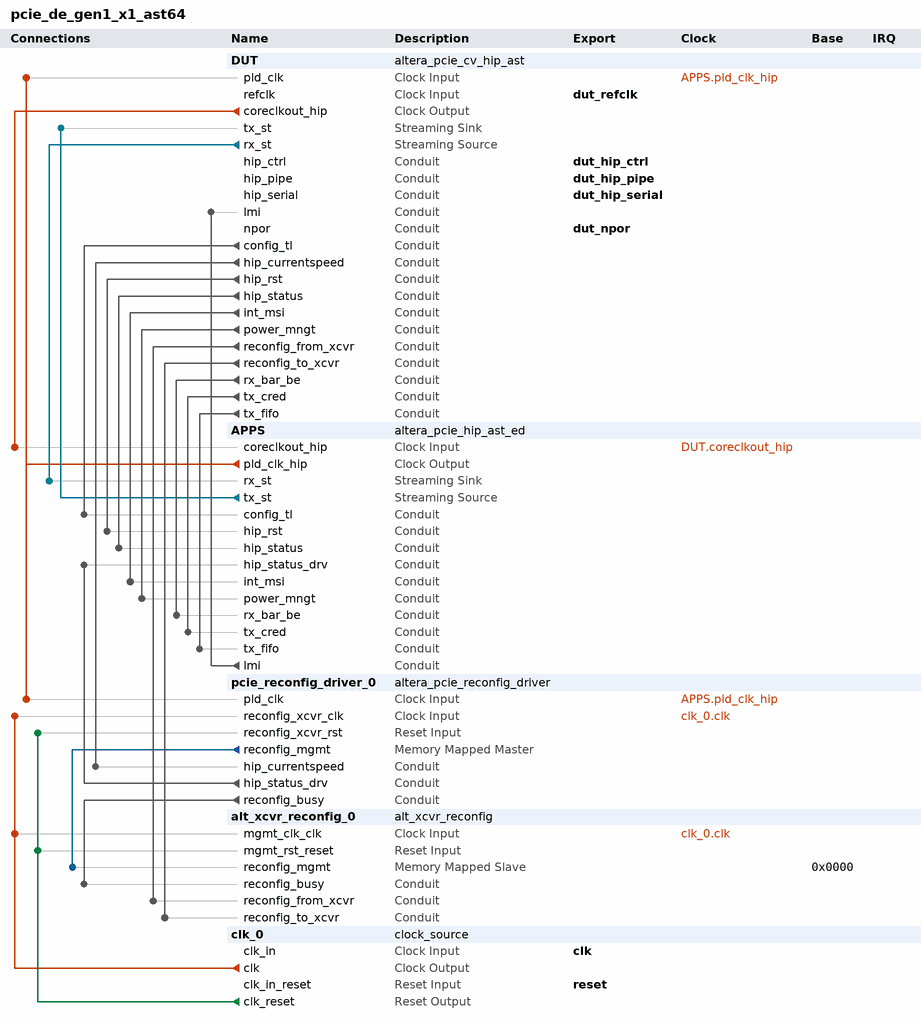
[diagram p0: system contents]
# Platform Designer (Qsys) system pcie_de_gen1_x1_ast64, Cyclone V Unknown
# Parameters at their usual value, and those the tool derives, are not listed.
package require -exact qsys 13.1
create_system pcie_de_gen1_x1_ast64
set_project_property DEVICE_FAMILY {Cyclone V}
set_project_property DEVICE Unknown

add_instance DUT altera_pcie_cv_hip_ast 13.1
set_instance_parameter_value DUT pcie_qsys 1
set_instance_parameter_value DUT altpcie_avmm_hwtcl 0
set_instance_parameter_value DUT lane_mask_hwtcl x1
set_instance_parameter_value DUT gen12_lane_rate_mode_hwtcl {Gen1 (2.5 Gbps)}
set_instance_parameter_value DUT porttype_func_hwtcl {Native endpoint}
set_instance_parameter_value DUT pcie_spec_version_hwtcl 2.1
set_instance_parameter_value DUT ast_width_hwtcl {Avalon-ST 64-bit}
set_instance_parameter_value DUT rxbuffer_rxreq_hwtcl Low
set_instance_parameter_value DUT pll_refclk_freq_hwtcl {100 MHz}
set_instance_parameter_value DUT set_pld_clk_x1_625MHz_hwtcl 0
set_instance_parameter_value DUT use_rx_st_be_hwtcl 1
set_instance_parameter_value DUT in_cvp_mode_hwtcl 0
set_instance_parameter_value DUT hip_reconfig_hwtcl 0
set_instance_parameter_value DUT num_of_func_hwtcl 1
set_instance_parameter_value DUT max_payload_size_hwtcl 128
set_instance_parameter_value DUT extend_tag_field_hwtcl 32
set_instance_parameter_value DUT completion_timeout_hwtcl ABCD
set_instance_parameter_value DUT enable_completion_timeout_disable_hwtcl 1
set_instance_parameter_value DUT use_aer_hwtcl 0
set_instance_parameter_value DUT ecrc_check_capable_hwtcl 0
set_instance_parameter_value DUT ecrc_gen_capable_hwtcl 0
set_instance_parameter_value DUT use_crc_forwarding_hwtcl 0
set_instance_parameter_value DUT port_link_number_hwtcl 1
set_instance_parameter_value DUT slotclkcfg_hwtcl 1
set_instance_parameter_value DUT enable_slot_register_hwtcl 0
set_instance_parameter_value DUT slot_power_scale_hwtcl 0
set_instance_parameter_value DUT slot_power_limit_hwtcl 0
set_instance_parameter_value DUT slot_number_hwtcl 0
set_instance_parameter_value DUT endpoint_l0_latency_hwtcl 0
set_instance_parameter_value DUT endpoint_l1_latency_hwtcl 0
set_instance_parameter_value DUT bar0_type_0_hwtcl 1
set_instance_parameter_value DUT bar0_size_mask_0_hwtcl 28
set_instance_parameter_value DUT bar1_type_0_hwtcl 0
set_instance_parameter_value DUT bar1_size_mask_0_hwtcl 0
set_instance_parameter_value DUT bar2_type_0_hwtcl 2
set_instance_parameter_value DUT bar2_size_mask_0_hwtcl 10
set_instance_parameter_value DUT bar3_type_0_hwtcl 0
set_instance_parameter_value DUT bar3_size_mask_0_hwtcl 0
set_instance_parameter_value DUT bar4_type_0_hwtcl 0
set_instance_parameter_value DUT bar4_size_mask_0_hwtcl 0
set_instance_parameter_value DUT bar5_type_0_hwtcl 0
set_instance_parameter_value DUT bar5_size_mask_0_hwtcl 0
set_instance_parameter_value DUT expansion_base_address_register_0_hwtcl 0
set_instance_parameter_value DUT io_window_addr_width_hwtcl 0
set_instance_parameter_value DUT prefetchable_mem_window_addr_width_hwtcl 0
set_instance_parameter_value DUT vendor_id_0_hwtcl 0
set_instance_parameter_value DUT device_id_0_hwtcl 1
set_instance_parameter_value DUT revision_id_0_hwtcl 1
set_instance_parameter_value DUT class_code_0_hwtcl 0
set_instance_parameter_value DUT subsystem_vendor_id_0_hwtcl 0
set_instance_parameter_value DUT subsystem_device_id_0_hwtcl 0
set_instance_parameter_value DUT flr_capability_0_hwtcl 0
set_instance_parameter_value DUT dll_active_report_support_0_hwtcl 0
set_instance_parameter_value DUT surprise_down_error_support_0_hwtcl 0
set_instance_parameter_value DUT msi_multi_message_capable_0_hwtcl 4
set_instance_parameter_value DUT msi_64bit_addressing_capable_0_hwtcl true
set_instance_parameter_value DUT msi_masking_capable_0_hwtcl false
set_instance_parameter_value DUT msi_support_0_hwtcl true
set_instance_parameter_value DUT enable_function_msix_support_0_hwtcl 0
set_instance_parameter_value DUT msix_table_size_0_hwtcl 0
set_instance_parameter_value DUT msix_table_offset_0_hwtcl 0
set_instance_parameter_value DUT msix_table_bir_0_hwtcl 0
set_instance_parameter_value DUT msix_pba_offset_0_hwtcl 0
set_instance_parameter_value DUT msix_pba_bir_0_hwtcl 0
set_instance_parameter_value DUT interrupt_pin_0_hwtcl inta
set_instance_parameter_value DUT force_hrc 0
set_instance_parameter_value DUT force_src 0
set_instance_parameter_value DUT set_l0s_hwtcl 0
set_instance_parameter_value DUT serial_sim_hwtcl 0
set_instance_parameter_value DUT override_rxbuffer_cred_preset 0
set_instance_parameter_value DUT advanced_default_parameter_override 0
set_instance_parameter_value DUT override_tbpartner_driver_setting_hwtcl 0
set_instance_parameter_value DUT enable_rx_buffer_checking_advanced_default_hwtcl false
set_instance_parameter_value DUT disable_link_x2_support_advanced_default_hwtcl false
set_instance_parameter_value DUT device_number_advanced_default_hwtcl 0
set_instance_parameter_value DUT pipex1_debug_sel_advanced_default_hwtcl disable
set_instance_parameter_value DUT pclk_out_sel_advanced_default_hwtcl pclk
set_instance_parameter_value DUT no_soft_reset_advanced_default_hwtcl false
set_instance_parameter_value DUT d1_support_advanced_default_hwtcl false
set_instance_parameter_value DUT d2_support_advanced_default_hwtcl false
set_instance_parameter_value DUT d0_pme_advanced_default_hwtcl false
set_instance_parameter_value DUT d1_pme_advanced_default_hwtcl false
set_instance_parameter_value DUT d2_pme_advanced_default_hwtcl false
set_instance_parameter_value DUT d3_hot_pme_advanced_default_hwtcl false
set_instance_parameter_value DUT d3_cold_pme_advanced_default_hwtcl false
set_instance_parameter_value DUT low_priority_vc_advanced_default_hwtcl single_vc
set_instance_parameter_value DUT enable_l1_aspm_advanced_default_hwtcl false
set_instance_parameter_value DUT l1_exit_latency_sameclock_advanced_default_hwtcl 0
set_instance_parameter_value DUT l1_exit_latency_diffclock_advanced_default_hwtcl 0
set_instance_parameter_value DUT hot_plug_support_advanced_default_hwtcl 0
set_instance_parameter_value DUT no_command_completed_advanced_default_hwtcl false
set_instance_parameter_value DUT eie_before_nfts_count_advanced_default_hwtcl 4
set_instance_parameter_value DUT gen2_diffclock_nfts_count_advanced_default_hwtcl 255
set_instance_parameter_value DUT gen2_sameclock_nfts_count_advanced_default_hwtcl 255
set_instance_parameter_value DUT deemphasis_enable_advanced_default_hwtcl false
set_instance_parameter_value DUT l0_exit_latency_sameclock_advanced_default_hwtcl 6
set_instance_parameter_value DUT l0_exit_latency_diffclock_advanced_default_hwtcl 6
set_instance_parameter_value DUT vc0_clk_enable_advanced_default_hwtcl true
set_instance_parameter_value DUT register_pipe_signals_advanced_default_hwtcl true
set_instance_parameter_value DUT tx_cdc_almost_empty_advanced_default_hwtcl 5
set_instance_parameter_value DUT rx_l0s_count_idl_advanced_default_hwtcl 0
set_instance_parameter_value DUT cdc_dummy_insert_limit_advanced_default_hwtcl 11
set_instance_parameter_value DUT ei_delay_powerdown_count_advanced_default_hwtcl 10
set_instance_parameter_value DUT skp_os_schedule_count_advanced_default_hwtcl 0
set_instance_parameter_value DUT fc_init_timer_advanced_default_hwtcl 1024
set_instance_parameter_value DUT l01_entry_latency_advanced_default_hwtcl 31
set_instance_parameter_value DUT flow_control_update_count_advanced_default_hwtcl 30
set_instance_parameter_value DUT flow_control_timeout_count_advanced_default_hwtcl 200
set_instance_parameter_value DUT retry_buffer_last_active_address_advanced_default_hwtcl 255
set_instance_parameter_value DUT reserved_debug_advanced_default_hwtcl 0
set_instance_parameter_value DUT use_tl_cfg_sync_advanced_default_hwtcl 1
set_instance_parameter_value DUT diffclock_nfts_count_advanced_default_hwtcl 255
set_instance_parameter_value DUT sameclock_nfts_count_advanced_default_hwtcl 255
set_instance_parameter_value DUT l2_async_logic_advanced_default_hwtcl disable
set_instance_parameter_value DUT rx_cdc_almost_full_advanced_default_hwtcl 12
set_instance_parameter_value DUT tx_cdc_almost_full_advanced_default_hwtcl 11
set_instance_parameter_value DUT indicator_advanced_default_hwtcl 0
set_instance_parameter_value DUT maximum_current_0_hwtcl 0
set_instance_parameter_value DUT disable_snoop_packet_0_hwtcl false
set_instance_parameter_value DUT bridge_port_vga_enable_0_hwtcl false
set_instance_parameter_value DUT bridge_port_ssid_support_0_hwtcl false
set_instance_parameter_value DUT ssvid_0_hwtcl 0
set_instance_parameter_value DUT ssid_0_hwtcl 0
set_instance_parameter_value DUT bar0_type_1_hwtcl 1
set_instance_parameter_value DUT bar0_size_mask_1_hwtcl 28
set_instance_parameter_value DUT bar1_type_1_hwtcl 0
set_instance_parameter_value DUT bar1_size_mask_1_hwtcl 0
set_instance_parameter_value DUT bar2_type_1_hwtcl 2
set_instance_parameter_value DUT bar2_size_mask_1_hwtcl 10
set_instance_parameter_value DUT bar3_type_1_hwtcl 0
set_instance_parameter_value DUT bar3_size_mask_1_hwtcl 0
set_instance_parameter_value DUT bar4_type_1_hwtcl 0
set_instance_parameter_value DUT bar4_size_mask_1_hwtcl 0
set_instance_parameter_value DUT bar5_type_1_hwtcl 0
set_instance_parameter_value DUT bar5_size_mask_1_hwtcl 0
set_instance_parameter_value DUT expansion_base_address_register_1_hwtcl 0
set_instance_parameter_value DUT vendor_id_1_hwtcl 0
set_instance_parameter_value DUT device_id_1_hwtcl 1
set_instance_parameter_value DUT revision_id_1_hwtcl 1
set_instance_parameter_value DUT class_code_1_hwtcl 0
set_instance_parameter_value DUT subsystem_vendor_id_1_hwtcl 0
set_instance_parameter_value DUT subsystem_device_id_1_hwtcl 0
set_instance_parameter_value DUT flr_capability_1_hwtcl 0
set_instance_parameter_value DUT dll_active_report_support_1_hwtcl 0
set_instance_parameter_value DUT surprise_down_error_support_1_hwtcl 0
set_instance_parameter_value DUT msi_multi_message_capable_1_hwtcl 4
set_instance_parameter_value DUT msi_64bit_addressing_capable_1_hwtcl true
set_instance_parameter_value DUT msi_masking_capable_1_hwtcl false
set_instance_parameter_value DUT msi_support_1_hwtcl true
set_instance_parameter_value DUT enable_function_msix_support_1_hwtcl 0
set_instance_parameter_value DUT msix_table_size_1_hwtcl 0
set_instance_parameter_value DUT msix_table_offset_1_hwtcl 0
set_instance_parameter_value DUT msix_table_bir_1_hwtcl 0
set_instance_parameter_value DUT msix_pba_offset_1_hwtcl 0
set_instance_parameter_value DUT msix_pba_bir_1_hwtcl 0
set_instance_parameter_value DUT interrupt_pin_1_hwtcl inta
set_instance_parameter_value DUT maximum_current_1_hwtcl 0
set_instance_parameter_value DUT disable_snoop_packet_1_hwtcl false
set_instance_parameter_value DUT bridge_port_vga_enable_1_hwtcl false
set_instance_parameter_value DUT bridge_port_ssid_support_1_hwtcl false
set_instance_parameter_value DUT ssvid_1_hwtcl 0
set_instance_parameter_value DUT ssid_1_hwtcl 0
set_instance_parameter_value DUT bar0_type_2_hwtcl 1
set_instance_parameter_value DUT bar0_size_mask_2_hwtcl 28
set_instance_parameter_value DUT bar1_type_2_hwtcl 0
set_instance_parameter_value DUT bar1_size_mask_2_hwtcl 0
set_instance_parameter_value DUT bar2_type_2_hwtcl 2
set_instance_parameter_value DUT bar2_size_mask_2_hwtcl 10
set_instance_parameter_value DUT bar3_type_2_hwtcl 0
set_instance_parameter_value DUT bar3_size_mask_2_hwtcl 0
set_instance_parameter_value DUT bar4_type_2_hwtcl 0
set_instance_parameter_value DUT bar4_size_mask_2_hwtcl 0
set_instance_parameter_value DUT bar5_type_2_hwtcl 0
set_instance_parameter_value DUT bar5_size_mask_2_hwtcl 0
set_instance_parameter_value DUT expansion_base_address_register_2_hwtcl 0
set_instance_parameter_value DUT vendor_id_2_hwtcl 0
set_instance_parameter_value DUT device_id_2_hwtcl 1
set_instance_parameter_value DUT revision_id_2_hwtcl 1
set_instance_parameter_value DUT class_code_2_hwtcl 0
set_instance_parameter_value DUT subsystem_vendor_id_2_hwtcl 0
set_instance_parameter_value DUT subsystem_device_id_2_hwtcl 0
set_instance_parameter_value DUT flr_capability_2_hwtcl 0
set_instance_parameter_value DUT dll_active_report_support_2_hwtcl 0
set_instance_parameter_value DUT surprise_down_error_support_2_hwtcl 0
set_instance_parameter_value DUT msi_multi_message_capable_2_hwtcl 4
set_instance_parameter_value DUT msi_64bit_addressing_capable_2_hwtcl true
set_instance_parameter_value DUT msi_masking_capable_2_hwtcl false
set_instance_parameter_value DUT msi_support_2_hwtcl true
set_instance_parameter_value DUT enable_function_msix_support_2_hwtcl 0
set_instance_parameter_value DUT msix_table_size_2_hwtcl 0
set_instance_parameter_value DUT msix_table_offset_2_hwtcl 0
set_instance_parameter_value DUT msix_table_bir_2_hwtcl 0
set_instance_parameter_value DUT msix_pba_offset_2_hwtcl 0
set_instance_parameter_value DUT msix_pba_bir_2_hwtcl 0
set_instance_parameter_value DUT interrupt_pin_2_hwtcl inta
set_instance_parameter_value DUT maximum_current_2_hwtcl 0
set_instance_parameter_value DUT disable_snoop_packet_2_hwtcl false
set_instance_parameter_value DUT bridge_port_vga_enable_2_hwtcl false
set_instance_parameter_value DUT bridge_port_ssid_support_2_hwtcl false
set_instance_parameter_value DUT ssvid_2_hwtcl 0
set_instance_parameter_value DUT ssid_2_hwtcl 0
set_instance_parameter_value DUT bar0_type_3_hwtcl 1
set_instance_parameter_value DUT bar0_size_mask_3_hwtcl 28
set_instance_parameter_value DUT bar1_type_3_hwtcl 0
set_instance_parameter_value DUT bar1_size_mask_3_hwtcl 0
set_instance_parameter_value DUT bar2_type_3_hwtcl 2
set_instance_parameter_value DUT bar2_size_mask_3_hwtcl 10
set_instance_parameter_value DUT bar3_type_3_hwtcl 0
set_instance_parameter_value DUT bar3_size_mask_3_hwtcl 0
set_instance_parameter_value DUT bar4_type_3_hwtcl 0
set_instance_parameter_value DUT bar4_size_mask_3_hwtcl 0
set_instance_parameter_value DUT bar5_type_3_hwtcl 0
set_instance_parameter_value DUT bar5_size_mask_3_hwtcl 0
set_instance_parameter_value DUT expansion_base_address_register_3_hwtcl 0
set_instance_parameter_value DUT vendor_id_3_hwtcl 0
set_instance_parameter_value DUT device_id_3_hwtcl 1
set_instance_parameter_value DUT revision_id_3_hwtcl 1
set_instance_parameter_value DUT class_code_3_hwtcl 0
set_instance_parameter_value DUT subsystem_vendor_id_3_hwtcl 0
set_instance_parameter_value DUT subsystem_device_id_3_hwtcl 0
set_instance_parameter_value DUT flr_capability_3_hwtcl 0
set_instance_parameter_value DUT dll_active_report_support_3_hwtcl 0
set_instance_parameter_value DUT surprise_down_error_support_3_hwtcl 0
set_instance_parameter_value DUT msi_multi_message_capable_3_hwtcl 4
set_instance_parameter_value DUT msi_64bit_addressing_capable_3_hwtcl true
set_instance_parameter_value DUT msi_masking_capable_3_hwtcl false
set_instance_parameter_value DUT msi_support_3_hwtcl true
set_instance_parameter_value DUT enable_function_msix_support_3_hwtcl 0
set_instance_parameter_value DUT msix_table_size_3_hwtcl 0
set_instance_parameter_value DUT msix_table_offset_3_hwtcl 0
set_instance_parameter_value DUT msix_table_bir_3_hwtcl 0
set_instance_parameter_value DUT msix_pba_offset_3_hwtcl 0
set_instance_parameter_value DUT msix_pba_bir_3_hwtcl 0
set_instance_parameter_value DUT interrupt_pin_3_hwtcl inta
set_instance_parameter_value DUT maximum_current_3_hwtcl 0
set_instance_parameter_value DUT disable_snoop_packet_3_hwtcl false
set_instance_parameter_value DUT bridge_port_vga_enable_3_hwtcl false
set_instance_parameter_value DUT bridge_port_ssid_support_3_hwtcl false
set_instance_parameter_value DUT ssvid_3_hwtcl 0
set_instance_parameter_value DUT ssid_3_hwtcl 0
set_instance_parameter_value DUT bar0_type_4_hwtcl 1
set_instance_parameter_value DUT bar0_size_mask_4_hwtcl 28
set_instance_parameter_value DUT bar1_type_4_hwtcl 0
set_instance_parameter_value DUT bar1_size_mask_4_hwtcl 0
set_instance_parameter_value DUT bar2_type_4_hwtcl 2
set_instance_parameter_value DUT bar2_size_mask_4_hwtcl 10
set_instance_parameter_value DUT bar3_type_4_hwtcl 0
set_instance_parameter_value DUT bar3_size_mask_4_hwtcl 0
set_instance_parameter_value DUT bar4_type_4_hwtcl 0
set_instance_parameter_value DUT bar4_size_mask_4_hwtcl 0
set_instance_parameter_value DUT bar5_type_4_hwtcl 0
set_instance_parameter_value DUT bar5_size_mask_4_hwtcl 0
set_instance_parameter_value DUT expansion_base_address_register_4_hwtcl 0
set_instance_parameter_value DUT vendor_id_4_hwtcl 0
set_instance_parameter_value DUT device_id_4_hwtcl 1
set_instance_parameter_value DUT revision_id_4_hwtcl 1
set_instance_parameter_value DUT class_code_4_hwtcl 0
set_instance_parameter_value DUT subsystem_vendor_id_4_hwtcl 0
set_instance_parameter_value DUT subsystem_device_id_4_hwtcl 0
set_instance_parameter_value DUT flr_capability_4_hwtcl 0
set_instance_parameter_value DUT dll_active_report_support_4_hwtcl 0
set_instance_parameter_value DUT surprise_down_error_support_4_hwtcl 0
set_instance_parameter_value DUT msi_multi_message_capable_4_hwtcl 4
set_instance_parameter_value DUT msi_64bit_addressing_capable_4_hwtcl true
set_instance_parameter_value DUT msi_masking_capable_4_hwtcl false
set_instance_parameter_value DUT msi_support_4_hwtcl true
set_instance_parameter_value DUT enable_function_msix_support_4_hwtcl 0
set_instance_parameter_value DUT msix_table_size_4_hwtcl 0
set_instance_parameter_value DUT msix_table_offset_4_hwtcl 0
set_instance_parameter_value DUT msix_table_bir_4_hwtcl 0
set_instance_parameter_value DUT msix_pba_offset_4_hwtcl 0
set_instance_parameter_value DUT msix_pba_bir_4_hwtcl 0
set_instance_parameter_value DUT interrupt_pin_4_hwtcl inta
set_instance_parameter_value DUT maximum_current_4_hwtcl 0
set_instance_parameter_value DUT disable_snoop_packet_4_hwtcl false
set_instance_parameter_value DUT bridge_port_vga_enable_4_hwtcl false
set_instance_parameter_value DUT bridge_port_ssid_support_4_hwtcl false
set_instance_parameter_value DUT ssvid_4_hwtcl 0
set_instance_parameter_value DUT ssid_4_hwtcl 0
set_instance_parameter_value DUT bar0_type_5_hwtcl 1
set_instance_parameter_value DUT bar0_size_mask_5_hwtcl 28
set_instance_parameter_value DUT bar1_type_5_hwtcl 0
set_instance_parameter_value DUT bar1_size_mask_5_hwtcl 0
set_instance_parameter_value DUT bar2_type_5_hwtcl 2
set_instance_parameter_value DUT bar2_size_mask_5_hwtcl 10
set_instance_parameter_value DUT bar3_type_5_hwtcl 0
set_instance_parameter_value DUT bar3_size_mask_5_hwtcl 0
set_instance_parameter_value DUT bar4_type_5_hwtcl 0
set_instance_parameter_value DUT bar4_size_mask_5_hwtcl 0
set_instance_parameter_value DUT bar5_type_5_hwtcl 0
set_instance_parameter_value DUT bar5_size_mask_5_hwtcl 0
set_instance_parameter_value DUT expansion_base_address_register_5_hwtcl 0
set_instance_parameter_value DUT vendor_id_5_hwtcl 0
set_instance_parameter_value DUT device_id_5_hwtcl 1
set_instance_parameter_value DUT revision_id_5_hwtcl 1
set_instance_parameter_value DUT class_code_5_hwtcl 0
set_instance_parameter_value DUT subsystem_vendor_id_5_hwtcl 0
set_instance_parameter_value DUT subsystem_device_id_5_hwtcl 0
set_instance_parameter_value DUT flr_capability_5_hwtcl 0
set_instance_parameter_value DUT dll_active_report_support_5_hwtcl 0
set_instance_parameter_value DUT surprise_down_error_support_5_hwtcl 0
set_instance_parameter_value DUT msi_multi_message_capable_5_hwtcl 4
set_instance_parameter_value DUT msi_64bit_addressing_capable_5_hwtcl true
set_instance_parameter_value DUT msi_masking_capable_5_hwtcl false
set_instance_parameter_value DUT msi_support_5_hwtcl true
set_instance_parameter_value DUT enable_function_msix_support_5_hwtcl 0
set_instance_parameter_value DUT msix_table_size_5_hwtcl 0
set_instance_parameter_value DUT msix_table_offset_5_hwtcl 0
set_instance_parameter_value DUT msix_table_bir_5_hwtcl 0
set_instance_parameter_value DUT msix_pba_offset_5_hwtcl 0
set_instance_parameter_value DUT msix_pba_bir_5_hwtcl 0
set_instance_parameter_value DUT interrupt_pin_5_hwtcl inta
set_instance_parameter_value DUT maximum_current_5_hwtcl 0
set_instance_parameter_value DUT disable_snoop_packet_5_hwtcl false
set_instance_parameter_value DUT bridge_port_vga_enable_5_hwtcl false
set_instance_parameter_value DUT bridge_port_ssid_support_5_hwtcl false
set_instance_parameter_value DUT ssvid_5_hwtcl 0
set_instance_parameter_value DUT ssid_5_hwtcl 0
set_instance_parameter_value DUT bar0_type_6_hwtcl 1
set_instance_parameter_value DUT bar0_size_mask_6_hwtcl 28
set_instance_parameter_value DUT bar1_type_6_hwtcl 0
set_instance_parameter_value DUT bar1_size_mask_6_hwtcl 0
set_instance_parameter_value DUT bar2_type_6_hwtcl 2
set_instance_parameter_value DUT bar2_size_mask_6_hwtcl 10
set_instance_parameter_value DUT bar3_type_6_hwtcl 0
set_instance_parameter_value DUT bar3_size_mask_6_hwtcl 0
set_instance_parameter_value DUT bar4_type_6_hwtcl 0
set_instance_parameter_value DUT bar4_size_mask_6_hwtcl 0
set_instance_parameter_value DUT bar5_type_6_hwtcl 0
set_instance_parameter_value DUT bar5_size_mask_6_hwtcl 0
set_instance_parameter_value DUT expansion_base_address_register_6_hwtcl 0
set_instance_parameter_value DUT vendor_id_6_hwtcl 0
set_instance_parameter_value DUT device_id_6_hwtcl 1
set_instance_parameter_value DUT revision_id_6_hwtcl 1
set_instance_parameter_value DUT class_code_6_hwtcl 0
set_instance_parameter_value DUT subsystem_vendor_id_6_hwtcl 0
set_instance_parameter_value DUT subsystem_device_id_6_hwtcl 0
set_instance_parameter_value DUT flr_capability_6_hwtcl 0
set_instance_parameter_value DUT dll_active_report_support_6_hwtcl 0
set_instance_parameter_value DUT surprise_down_error_support_6_hwtcl 0
set_instance_parameter_value DUT msi_multi_message_capable_6_hwtcl 4
set_instance_parameter_value DUT msi_64bit_addressing_capable_6_hwtcl true
set_instance_parameter_value DUT msi_masking_capable_6_hwtcl false
set_instance_parameter_value DUT msi_support_6_hwtcl true
set_instance_parameter_value DUT enable_function_msix_support_6_hwtcl 0
set_instance_parameter_value DUT msix_table_size_6_hwtcl 0
set_instance_parameter_value DUT msix_table_offset_6_hwtcl 0
set_instance_parameter_value DUT msix_table_bir_6_hwtcl 0
set_instance_parameter_value DUT msix_pba_offset_6_hwtcl 0
set_instance_parameter_value DUT msix_pba_bir_6_hwtcl 0
set_instance_parameter_value DUT interrupt_pin_6_hwtcl inta
set_instance_parameter_value DUT maximum_current_6_hwtcl 0
set_instance_parameter_value DUT disable_snoop_packet_6_hwtcl false
set_instance_parameter_value DUT bridge_port_vga_enable_6_hwtcl false
set_instance_parameter_value DUT bridge_port_ssid_support_6_hwtcl false
set_instance_parameter_value DUT ssvid_6_hwtcl 0
set_instance_parameter_value DUT ssid_6_hwtcl 0
set_instance_parameter_value DUT bar0_type_7_hwtcl 1
set_instance_parameter_value DUT bar0_size_mask_7_hwtcl 28
set_instance_parameter_value DUT bar1_type_7_hwtcl 0
set_instance_parameter_value DUT bar1_size_mask_7_hwtcl 0
set_instance_parameter_value DUT bar2_type_7_hwtcl 2
set_instance_parameter_value DUT bar2_size_mask_7_hwtcl 10
set_instance_parameter_value DUT bar3_type_7_hwtcl 0
set_instance_parameter_value DUT bar3_size_mask_7_hwtcl 0
set_instance_parameter_value DUT bar4_type_7_hwtcl 0
set_instance_parameter_value DUT bar4_size_mask_7_hwtcl 0
set_instance_parameter_value DUT bar5_type_7_hwtcl 0
set_instance_parameter_value DUT bar5_size_mask_7_hwtcl 0
set_instance_parameter_value DUT expansion_base_address_register_7_hwtcl 0
set_instance_parameter_value DUT vendor_id_7_hwtcl 0
set_instance_parameter_value DUT device_id_7_hwtcl 1
set_instance_parameter_value DUT revision_id_7_hwtcl 1
set_instance_parameter_value DUT class_code_7_hwtcl 0
set_instance_parameter_value DUT subsystem_vendor_id_7_hwtcl 0
set_instance_parameter_value DUT subsystem_device_id_7_hwtcl 0
set_instance_parameter_value DUT flr_capability_7_hwtcl 0
set_instance_parameter_value DUT dll_active_report_support_7_hwtcl 0
set_instance_parameter_value DUT surprise_down_error_support_7_hwtcl 0
set_instance_parameter_value DUT msi_multi_message_capable_7_hwtcl 4
set_instance_parameter_value DUT msi_64bit_addressing_capable_7_hwtcl true
set_instance_parameter_value DUT msi_masking_capable_7_hwtcl false
set_instance_parameter_value DUT msi_support_7_hwtcl true
set_instance_parameter_value DUT enable_function_msix_support_7_hwtcl 0
set_instance_parameter_value DUT msix_table_size_7_hwtcl 0
set_instance_parameter_value DUT msix_table_offset_7_hwtcl 0
set_instance_parameter_value DUT msix_table_bir_7_hwtcl 0
set_instance_parameter_value DUT msix_pba_offset_7_hwtcl 0
set_instance_parameter_value DUT msix_pba_bir_7_hwtcl 0
set_instance_parameter_value DUT interrupt_pin_7_hwtcl inta
set_instance_parameter_value DUT maximum_current_7_hwtcl 0
set_instance_parameter_value DUT disable_snoop_packet_7_hwtcl false
set_instance_parameter_value DUT bridge_port_vga_enable_7_hwtcl false
set_instance_parameter_value DUT bridge_port_ssid_support_7_hwtcl false
set_instance_parameter_value DUT ssvid_7_hwtcl 0
set_instance_parameter_value DUT ssid_7_hwtcl 0
set_instance_parameter_value DUT rpre_emph_a_val_hwtcl 11
set_instance_parameter_value DUT rpre_emph_b_val_hwtcl 0
set_instance_parameter_value DUT rpre_emph_c_val_hwtcl 22
set_instance_parameter_value DUT rpre_emph_d_val_hwtcl 12
set_instance_parameter_value DUT rpre_emph_e_val_hwtcl 21
set_instance_parameter_value DUT rvod_sel_a_val_hwtcl 50
set_instance_parameter_value DUT rvod_sel_b_val_hwtcl 34
set_instance_parameter_value DUT rvod_sel_c_val_hwtcl 50
set_instance_parameter_value DUT rvod_sel_d_val_hwtcl 50
set_instance_parameter_value DUT rvod_sel_e_val_hwtcl 9

add_instance APPS altera_pcie_hip_ast_ed 13.1
set_instance_parameter_value APPS device_family_hwtcl {Cyclone V}
set_instance_parameter_value APPS lane_mask_hwtcl x1
set_instance_parameter_value APPS gen123_lane_rate_mode_hwtcl {Gen1 (2.5 Gbps)}
set_instance_parameter_value APPS pld_clockrate_hwtcl 125000000
set_instance_parameter_value APPS port_type_hwtcl {Native endpoint}
set_instance_parameter_value APPS ast_width_hwtcl {Avalon-ST 64-bit}
set_instance_parameter_value APPS extend_tag_field_hwtcl 32
set_instance_parameter_value APPS max_payload_size_hwtcl 128
set_instance_parameter_value APPS num_of_func_hwtcl 1
set_instance_parameter_value APPS use_rx_st_be_hwtcl 1
set_instance_parameter_value APPS multiple_packets_per_cycle_hwtcl 0
set_instance_parameter_value APPS track_rxfc_cplbuf_ovf_hwtcl 0
set_instance_parameter_value APPS avalon_waddr_hwltcl 12
set_instance_parameter_value APPS check_bus_master_ena_hwtcl 1
set_instance_parameter_value APPS check_rx_buffer_cpl_hwtcl 1
set_instance_parameter_value APPS use_crc_forwarding_hwtcl 0
set_instance_parameter_value APPS use_ep_simple_downstream_apps_hwtcl 0

add_instance pcie_reconfig_driver_0 altera_pcie_reconfig_driver 1.0
set_instance_parameter_value pcie_reconfig_driver_0 gen123_lane_rate_mode_hwtcl {Gen1 (2.5 Gbps)}
set_instance_parameter_value pcie_reconfig_driver_0 number_of_reconfig_interfaces 2

add_instance alt_xcvr_reconfig_0 alt_xcvr_reconfig 13.1
set_instance_parameter_value alt_xcvr_reconfig_0 device_family {Cyclone V}
set_instance_parameter_value alt_xcvr_reconfig_0 number_of_reconfig_interfaces 2
set_instance_parameter_value alt_xcvr_reconfig_0 enable_analog 0
set_instance_parameter_value alt_xcvr_reconfig_0 enable_adce 0

add_instance clk_0 clock_source 13.1
set_instance_parameter_value clk_0 clockFrequency 50000000

# connections
add_connection APPS.pld_clk_hip DUT.pld_clk clock
add_connection APPS.pld_clk_hip pcie_reconfig_driver_0.pld_clk clock
add_connection clk_0.clk alt_xcvr_reconfig_0.mgmt_clk_clk clock
add_connection clk_0.clk pcie_reconfig_driver_0.reconfig_xcvr_clk clock
add_connection DUT.coreclkout_hip APPS.coreclkout_hip clock
add_connection clk_0.clk_reset alt_xcvr_reconfig_0.mgmt_rst_reset reset
add_connection clk_0.clk_reset pcie_reconfig_driver_0.reconfig_xcvr_rst reset
add_connection pcie_reconfig_driver_0.reconfig_mgmt alt_xcvr_reconfig_0.reconfig_mgmt avalon
set_connection_parameter_value pcie_reconfig_driver_0.reconfig_mgmt/alt_xcvr_reconfig_0.reconfig_mgmt baseAddress 0x0000
add_connection APPS.tx_st DUT.tx_st avalon_streaming
add_connection DUT.rx_st APPS.rx_st avalon_streaming
add_connection APPS.lmi DUT.lmi conduit
add_connection DUT.config_tl APPS.config_tl conduit
add_connection DUT.hip_currentspeed pcie_reconfig_driver_0.hip_currentspeed conduit
add_connection DUT.hip_rst APPS.hip_rst conduit
add_connection DUT.hip_status APPS.hip_status conduit
add_connection DUT.int_msi APPS.int_msi conduit
add_connection DUT.power_mngt APPS.power_mngt conduit
add_connection DUT.reconfig_from_xcvr alt_xcvr_reconfig_0.reconfig_from_xcvr conduit
add_connection DUT.reconfig_to_xcvr alt_xcvr_reconfig_0.reconfig_to_xcvr conduit
add_connection DUT.rx_bar_be APPS.rx_bar_be conduit
add_connection DUT.tx_cred APPS.tx_cred conduit
add_connection DUT.tx_fifo APPS.tx_fifo conduit
add_connection pcie_reconfig_driver_0.hip_status_drv APPS.hip_status_drv conduit
add_connection pcie_reconfig_driver_0.reconfig_busy alt_xcvr_reconfig_0.reconfig_busy conduit

# exported interfaces
add_interface dut_npor conduit end
set_interface_property dut_npor EXPORT_OF DUT.npor
add_interface dut_hip_ctrl conduit end
set_interface_property dut_hip_ctrl EXPORT_OF DUT.hip_ctrl
add_interface dut_refclk clock sink
set_interface_property dut_refclk EXPORT_OF DUT.refclk
add_interface dut_hip_pipe conduit end
set_interface_property dut_hip_pipe EXPORT_OF DUT.hip_pipe
add_interface dut_hip_serial conduit end
set_interface_property dut_hip_serial EXPORT_OF DUT.hip_serial
add_interface clk clock sink
set_interface_property clk EXPORT_OF clk_0.clk_in
add_interface reset reset sink
set_interface_property reset EXPORT_OF clk_0.clk_in_reset

set_interconnect_requirement {$system} qsys_mm.clockCrossingAdapter HANDSHAKE
set_interconnect_requirement {$system} qsys_mm.maxAdditionalLatency 0

save_system pcie_de_gen1_x1_ast64.qsys
